# Altium schematic sheet Sheet2.SchDoc
size A; SheetNumber: 1; SheetTotal: 1
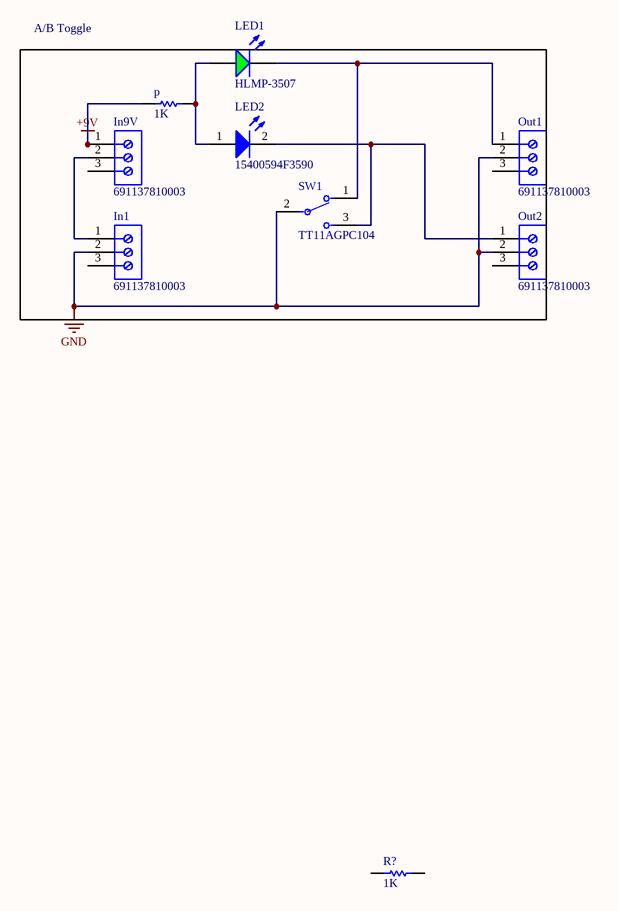
[diagram p0: Sheet2.SchDoc]

## Parts
In1  691137810003  [691137810003]
In9V  691137810003  [691137810003]
LED1  HLMP-3507  [AVAG-HLMP-3507]
LED2  15400594F3590  [WL-TIRC_5mm]
Out1  691137810003  [691137810003]
Out2  691137810003  [691137810003]
p  value 1K  (hidden comment: Resistor)
R?  value 1K  (hidden comment: Resistor)
SW1  TT11AGPC104  [FP-TT11AGPC104-MFG]

## Blocks framed on the sheet
A/B Toggle: In1 In9V LED1 LED2 Out1 Out2 p SW1

## Nets
+9V: In9V.1 p.1
GND: In1.2 Out1.2 Out2.2 SW1.2
NetIn1_1: In1.1 In9V.2
NetLED1_1: LED1.1(A) LED2.1(A) p.2
NetLED1_2: LED1.2(K) Out1.1 SW1.1
NetLED2_2: LED2.2(K) Out2.1 SW1.3

Not connected (* = marked no-connect by the designer): In1 3; In9V 3; Out1 3; Out2 3; R? 1 2

## Library data of the parts
In1 In9V Out1 Out2 = CMP-1502-03382-2: NexarPartId: 105950636
LED1 = CMP-2000-06412-1: T-1 3/4 (5 mm) Diffused LED Lamp, Green, 2.1 V, -20 to 100 degC, 2-Pin THD, RoHS, Bulk; Manufacturer: Avago; Type: Uni-Color; Reverse Voltage: 5V; Product Depth (mm): 6.1mm; Lum Intensity: 4.2mcd; Chip Material: GaP; Emitting Color: YellowGreen; Number of  Elements: 1; Forward Voltage: 2.7V; Dominant Wave Length: 569nm; Peak Wavelength: 565nm; Rad Hardened: No; Shape Type: Circular; Forward Current: 25mA; Product Height (mm): 9.19mm; Power Dissipation: 85W; Viewing Angle: 60deg; Main Category: StandardLED; Lens Type: ColoredDiffused; Test Current (It): 10mA; DELETED: Compliant; Package Description: 2-Pin Through Hole Device, Dia 5.845 mm, Pitch 2.54 mm; Datasheet URL: http://docs.avagotech.com/docs/AV02-1558EN; Operating Temperature Classification: Industrial; Pin Count: 2; Datasheet Version: 03/2015; Operating Temp Range: -40Cto100C; Package Reference: HLMP-3507; Mounting: ThroughHole; Mounting Technology: ThroughHole; Manufacturer URL: http://www.avagotech.com/; High Brightness: No; Luminous Intensity: 4.2mcd; Package Type: T-13/4; Product Length (mm): 6.1mm; Lens Dimensions: 5.08x5.08x8.3mm
LED2 = CMP-03913-110288041-1: 15400594F3590 Led, 5Mm, 940Nm, 30Mw/Sr, Th Rohs Compliant: Yes; Viewing Angle: 30°; Forward Current: 1A; Max Reverse Voltage (DC): 5V; Forward Voltage: 1.3V; RoHS: Compliant; Max Operating Temperature: 85°C; Peak Wavelength: 940nm; Min Operating Temperature: -40°C; NexarPartId: 110288041
p R? = Resistor: TC1: 0; SimulationGenericComponent: True; TC2: 0
SW1 = CMP-03408-000020-1: SWITCH TOGGLE SPST 0.4VA 20V; Illumination Type: Illuminated; Actuator Length: 5.61mm; Contact Current Rating: 3A; Power Rating: 400mW; Voltage Rating (AC): 20V; Packaging: Bulk; Max Voltage Rating (DC): 20V; Actuator Type: Toggle; Orientation: Straight; RoHS Compliant: Yes; Throw Configuration: SPST; Min Operating Temperature: -30°C; Voltage Rating (DC): 20V; Series: TT (Tiny); Contact Plating: Gold; Package Quantity: 25; Max Operating Temperature: 85°C; Mount: Brackets; Termination: PC Pins; Max Voltage Rating (AC): 20V